# Altium project PS1-1BC.PrjPcb
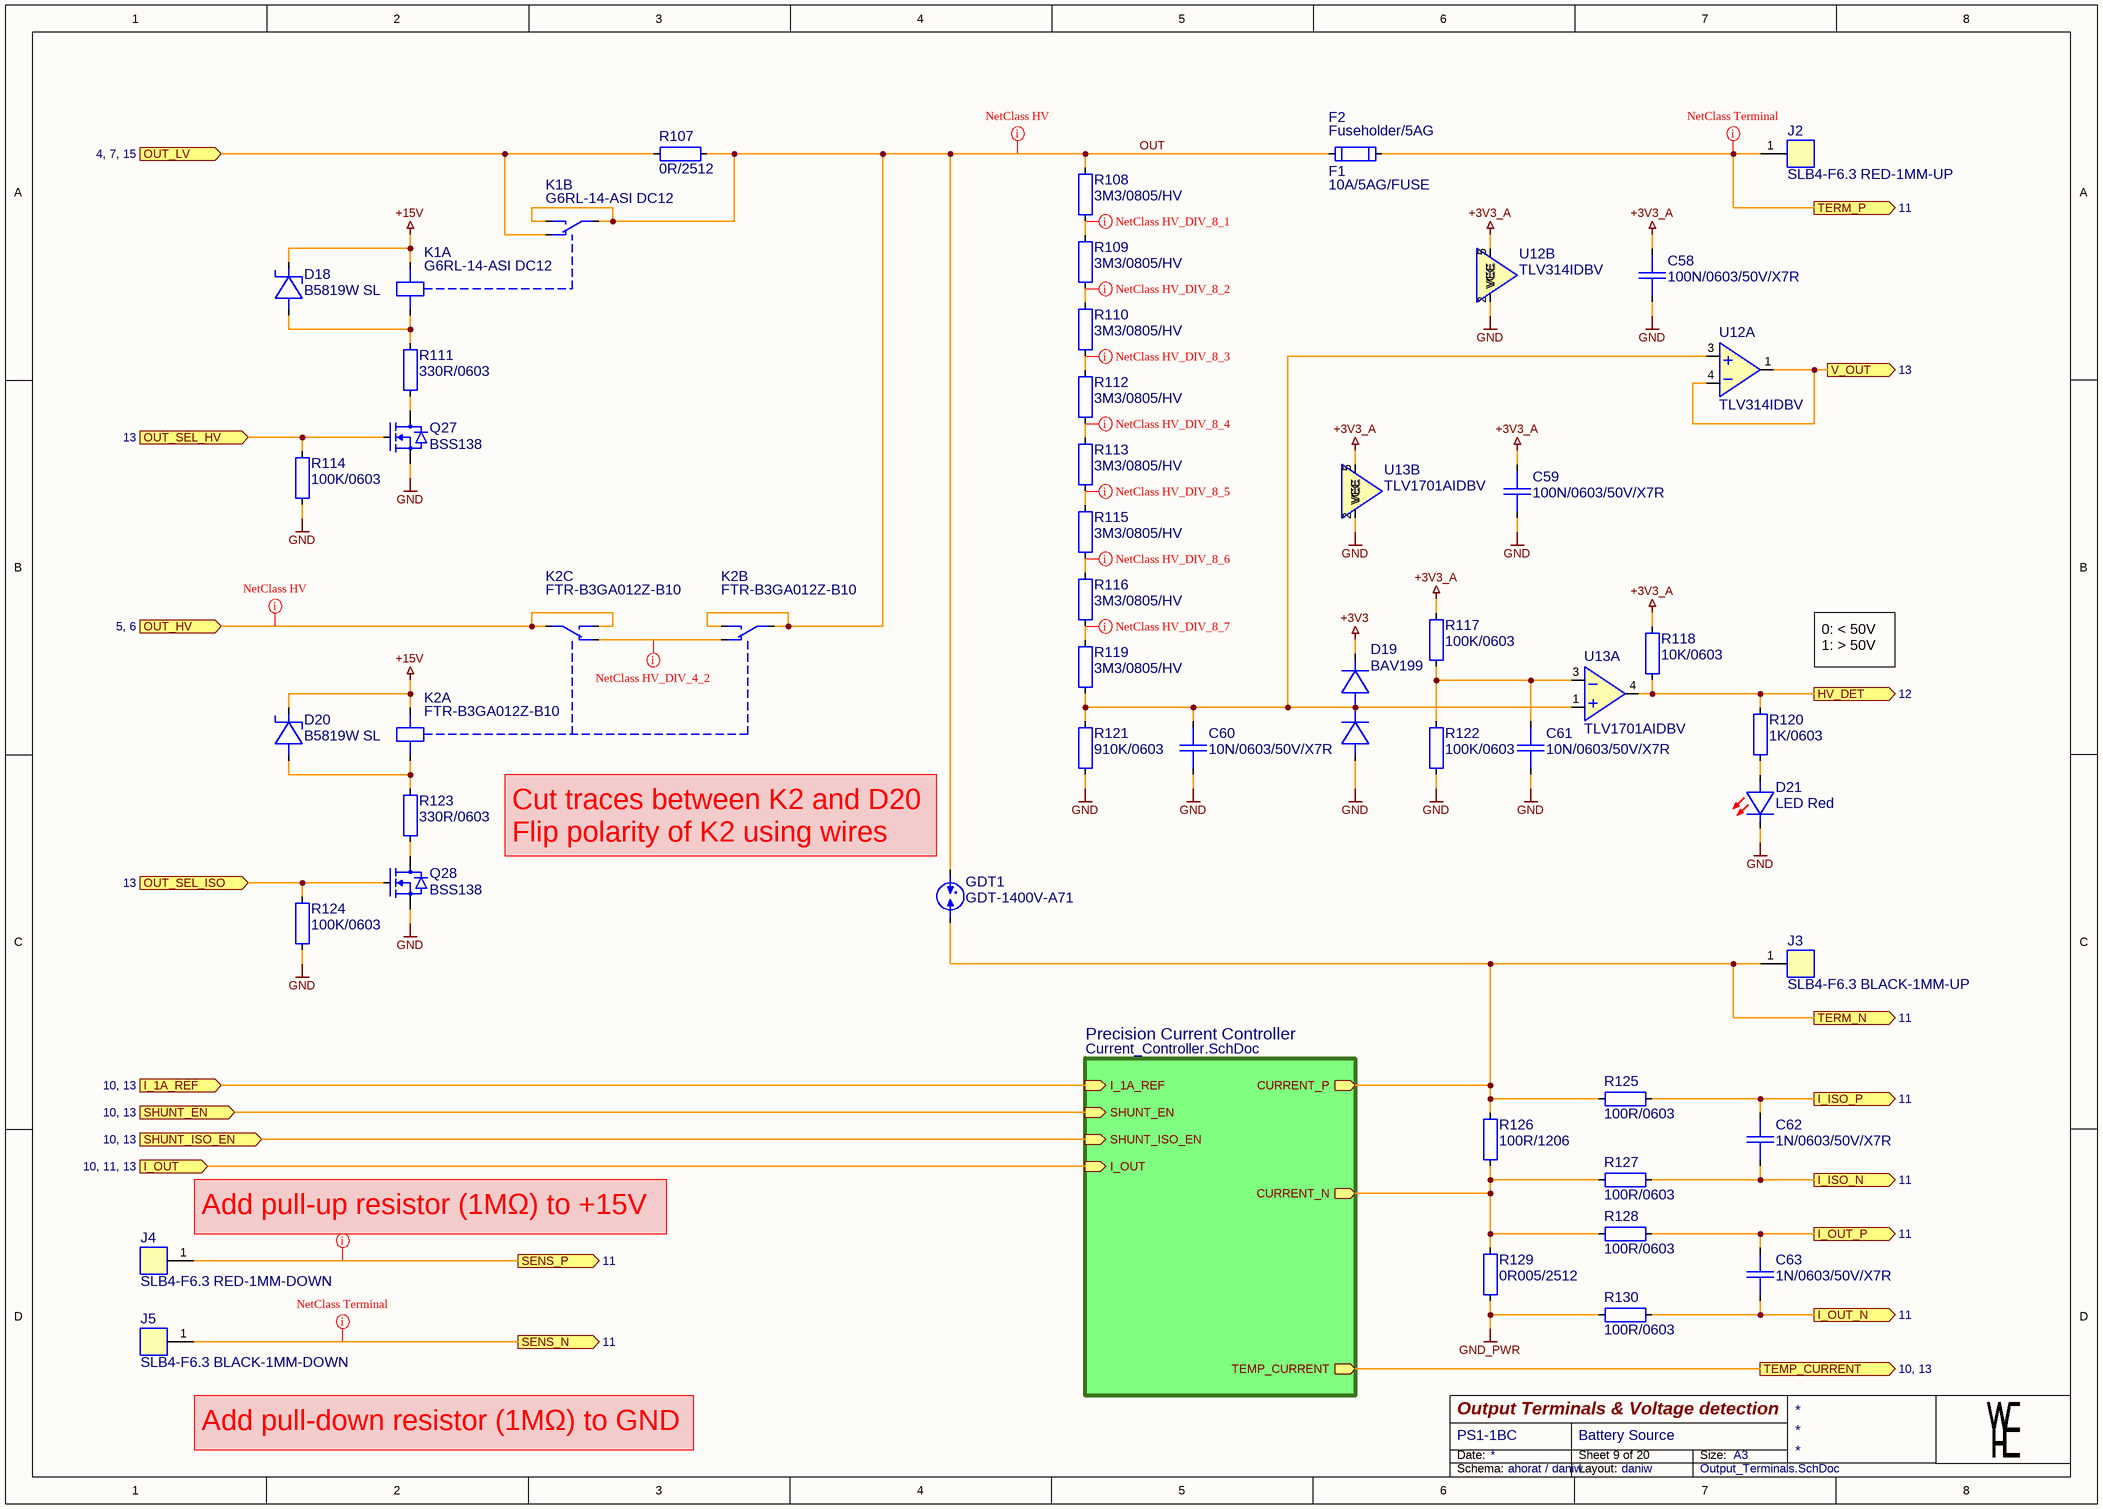
[diagram p0: Output_Terminals.SchDoc]
Schema_Designer: ahorat / daniw; Project_URL: https://github.com/daniw/bat_source; Project: Battery Source; PCB_NAME: PS1-1; Layout_Designer: daniw; Index_Sub: C; Index_Main: B; Author: ahorat / daniw
1 sheet, 47 parts. Net scope: hierarchical (ports join the sheet entries above them; power ports are global).
Board files: PS1-1B-BASIS.PcbDoc, PS1-1B-PANEL.PcbDoc

## Sheet Output_Terminals.SchDoc: Output Terminals & Voltage detection
size A3; DocumentNumber: 9; SheetNumber: 9; SheetTotal: 20

### Parts
C58  100N/0603/50V/X7R  [CAP0603_X7R]
C59  100N/0603/50V/X7R  [CAP0603_X7R]
C60  10N/0603/50V/X7R  [CAP0603_X7R]
C61  10N/0603/50V/X7R  [CAP0603_X7R]
C62  1N/0603/50V/X7R  [CAP0603_X7R]
C63  1N/0603/50V/X7R  [CAP0603_X7R]
D18  B5819W SL  [SOD3718X125]
D19  BAV199  [SOT2395P280X125-3-SE]
D20  B5819W SL  [SOD3718X125]
D21  LED Red  [LED0805_RED]
F1  10A/5AG/FUSE  [Fuse_5AG_5mm]
F2  Fuseholder/5AG  [KEYSTONE_3576]
GDT1  GDT-1400V-A71  [GDTAD1200W100L800D800H1200]
J2  SLB4-F6.3 RED-1MM-UP  [SLB4-F6.3-RED]
J3  SLB4-F6.3 BLACK-1MM-UP  [SLB4-F6.3-BLACK]
J4  SLB4-F6.3 RED-1MM-DOWN  [SLB4-F6.3-RED]
J5  SLB4-F6.3 BLACK-1MM-DOWN  [SLB4-F6.3-BLACK]
K1  G6RL-14-ASI DC12  [G6RL-1]  (parts A,B of 2)
K2  FTR-B3GA012Z-B10  [FTR-B3G]  (parts A,B,C of 3)
Q27  BSS138  [SOT2395P280X125-3-SE]
Q28  BSS138  [SOT2395P280X125-3-SE]
R107  0R/2512  [R2512-0.65-WW]
R108  3M3/0805/HV  [R0805-0.50-HV-WW]
R109  3M3/0805/HV  [R0805-0.50-HV-WW]
R110  3M3/0805/HV  [R0805-0.50-HV-WW]
R111  330R/0603  [R0603-0.40-WW]
R112  3M3/0805/HV  [R0805-0.50-HV-WW]
R113  3M3/0805/HV  [R0805-0.50-HV-WW]
R114  100K/0603  [R0603-0.40-WW]
R115  3M3/0805/HV  [R0805-0.50-HV-WW]
R116  3M3/0805/HV  [R0805-0.50-HV-WW]
R117  100K/0603  [R0603-0.40-WW]
R118  10K/0603  [R0603-0.40-WW]
R119  3M3/0805/HV  [R0805-0.50-HV-WW]
R120  1K/0603  [R0603-0.40-WW]
R121  910K/0603  [R0603-0.40-WW]
R122  100K/0603  [R0603-0.40-WW]
R123  330R/0603  [R0603-0.40-WW]
R124  100K/0603  [R0603-0.40-WW]
R125  100R/0603  [R0603-0.40-WW]
R126  100R/1206  [R1206-0.80-WW]
R127  100R/0603  [R0603-0.40-WW]
R128  100R/0603  [R0603-0.40-WW]
R129  0R005/2512  [R2512-0.65-WW]
R130  100R/0603  [R0603-0.40-WW]
U12  TLV314IDBV  [SOT2395P280X125-5-NW]  (parts A,B of 2)
U13  TLV1701AIDBV  [SOT2395P280X125-5-NW]  (parts A,B of 2)

### Sub-sheets
Precision Current Controller = Current_Controller.SchDoc (file not in this document): I_1A_REF (in), SHUNT_EN (in), SHUNT_ISO_EN (in), I_OUT (in), TEMP_CURRENT (out), CURRENT_P (out), CURRENT_N (out)

### Ports
HV_DET (out, see 12), I_1A_REF (in, see 10, 13), I_ISO_N (out, see 11), I_ISO_P (out, see 11), I_OUT (in, see 10, 11, 13), I_OUT_N (out, see 11), I_OUT_P (out, see 11), OUT_HV (in, see 5, 6), OUT_LV (in, see 4, 7, 15), OUT_SEL_HV (in, see 13), OUT_SEL_ISO (in, see 13), SENS_N (out, see 11), SENS_P (out, see 11), SHUNT_EN (in, see 10, 13), SHUNT_ISO_EN (in, see 10, 13), TEMP_CURRENT (out, see 10, 13), TERM_N (out, see 11), TERM_P (out, see 11), V_OUT (out, see 13)

### Nets
+3V3: D19.2(K2)
+3V3_A: C58.1 C59.1 R117.1 R118.1 U12.5(VCC) U13.5(VCC)
+15V: D18.1(C) D20.1(C) K1.2 K2.2
GND: C58.2 C59.2 C60.2 C61.2 D19.1(A1) D21.1(C) Q27.2(SOURCE) Q28.2(SOURCE) R114.2 R121.2 R122.2 R124.2 U12.2(VEE) U13.2(VEE)
GND_PWR: R129.2 R130.1
OUT: F2.1 GDT1.1 K1.3(COM1) K1.5(NO1) K2.3(COM1) K2.5(NO1) R107.1 R108.1
NetC60_1: C60.1 D19.3(K1/A2) R119.2 R121.1 U12.3(IN+) U13.1(IN+)
NetC61_1: C61.1 R117.2 R122.1 U13.3(IN-)
NetC62_1: C62.1 R125.2 ; port I_ISO_P
NetC62_2: C62.2 R127.2 ; port I_ISO_N
NetC63_1: C63.1 R128.2 ; port I_OUT_P
NetC63_2: C63.2 R130.2 ; port I_OUT_N
NetD18_2: D18.2(A) K1.1 R111.1
NetD20_2: D20.2(A) K2.1 R123.1
NetD21_2: D21.2(A) R120.1
NetF2_2: F2.2 J2.1 ; port TERM_P
NetGDT1_2: GDT1.2 J3.1 R125.1 R126.1 ; port TERM_N, sheet Precision Current Controller/CURRENT_P
NetJ4_1: J4.1 ; port SENS_P
NetJ5_1: J5.1 ; port SENS_N
NetK1_4: K1.4(NC1) R107.2 ; port OUT_LV
NetK2_4: K2.4(NC1) K2.7(NC2)
NetK2_6: K2.6(COM2) K2.8(NO2) ; port OUT_HV
NetQ27_1: Q27.1(GATE) R114.1 ; port OUT_SEL_HV
NetQ27_3: Q27.3(DRAIN) R111.2
NetQ28_1: Q28.1(GATE) R124.1 ; port OUT_SEL_ISO
NetQ28_3: Q28.3(DRAIN) R123.2
NetR108_2: R108.2 R109.1
NetR109_2: R109.2 R110.1
NetR110_2: R110.2 R112.1
NetR112_2: R112.2 R113.1
NetR113_2: R113.2 R115.1
NetR115_2: R115.2 R116.1
NetR116_2: R116.2 R119.1
NetR118_2: R118.2 R120.2 U13.4(OUT) ; port HV_DET
NetR126_2: R126.2 R127.1 R128.1 R129.1 ; sheet Precision Current Controller/CURRENT_N
NetU12_1: U12.1(OUT) U12.4(IN-) ; port V_OUT
(unnamed): port I_1A_REF, sheet Precision Current Controller/I_1A_REF
(unnamed): port SHUNT_EN, sheet Precision Current Controller/SHUNT_EN
(unnamed): port SHUNT_ISO_EN, sheet Precision Current Controller/SHUNT_ISO_EN
(unnamed): port I_OUT, sheet Precision Current Controller/I_OUT
(unnamed): port TEMP_CURRENT, sheet Precision Current Controller/TEMP_CURRENT

### Layout directives
net class HV: NetK2_6, OUT
net class Terminal: NetF2_2, NetJ4_1, NetJ5_1
net class HV_DIV_8_1: NetR108_2
net class HV_DIV_8_2: NetR109_2
net class HV_DIV_8_3: NetR110_2
net class HV_DIV_4_2: NetK2_4
net class HV_DIV_8_4: NetR112_2
net class HV_DIV_8_5: NetR113_2
net class HV_DIV_8_6: NetR115_2
net class HV_DIV_8_7: NetR116_2

### Notes on the sheet
- 0: < 50V
  1: > 50V
- (near GDT1) Cut traces between K2 and D20
  Flip polarity of K2 using wires
- Alternate relay options:
  - IM06CGR
  (fits on same footprint)
  - IM06JR
  (requires different footprint)
- (near J4) Add pull-up resistor (1MΩ) to +15V
- Add pull-down resistor (1MΩ) to GND
- Date:
- Size:
- A3
- Schema:
- Layout:

### Library data of the parts
C58 C59 = 100N/0603/50V/X7R: CAP SM 0603 100nF 50V X7R; Manufacturer: GENERIC; Manufacturer 1: YAGEO; Manufacturer Part Number 1: CC0603KPX7R9BB104; Absolute Value: 1E-7; Eurocircuits GPN: GPC0603104; Part Number: 100N/0603/50V/X7R; Package: 0603; Value: 100nF; HelpURL: https://www.yageo.com/upload/media/product/app/datasheet/mlcc/upy-gphc_x7r_6_3v-to-250v.pdf; Supplier 1: Digi-Key; Supplier Part Number 1: 311-3567-1-ND; Supplier 3: LCSC; Supplier Part Number 3: C14663; Manufacturer 2: YAGEO; Manufacturer Part Number 2: CC0603MRX7R9BB104; Supplier 2: Digi-Key; Supplier Part Number 2: 311-4110-1-ND; JLC Type: Basic; Manufacturer Part Number 3: CC0603KRX7R9BB104
C60 C61 = 10N/0603/50V/X7R: CAP SM 0603 10nF 50V X7R; Manufacturer: GENERIC; Manufacturer 1: YAGEO; Manufacturer Part Number 1: CC0603KPX7R9BB103; Absolute Value: 1E-8; Eurocircuits GPN: GPC0603103; Part Number: 10N/0603/50V/X7R; Package: 0603; Value: 10nF; HelpURL: https://www.yageo.com/upload/media/product/app/datasheet/mlcc/upy-gphc_x7r_6_3v-to-250v.pdf; Supplier 1: Digi-Key; Supplier Part Number 1: 311-1572-1-ND; Manufacturer 2: YAGEO; Manufacturer Part Number 2: CC0603KRX7R9BB103; Supplier 2: Digi-Key; Supplier Part Number 2: 311-1085-1-ND; Manufacturer Part Number 3: CC0603KRX7R9BB103; Supplier 3: LCSC; Supplier Part Number 3: C100042
C62 C63 = 1N/0603/50V/X7R: CAP SM 0603 1.0nF 50V X7R; Manufacturer: GENERIC; Manufacturer 1: YAGEO; Manufacturer Part Number 1: CC0603KPX7R9BB102; Absolute Value: 1E-9; Eurocircuits GPN: GPC0603102; Part Number: 1N/0603/50V/X7R; Package: 0603; Value: 1.0nF; HelpURL: https://www.yageo.com/upload/media/product/app/datasheet/mlcc/upy-gphc_x7r_6_3v-to-250v.pdf; Supplier 1: Digi-Key; Supplier Part Number 1: 13-CC0603KPX7R9BB102CT-ND; Manufacturer 2: YAGEO; Manufacturer Part Number 2: CC0603KRX7R9BB102; Supplier 2: Digi-Key; Supplier Part Number 2: 311-1080-1-ND; JLC Type: Basic; Manufacturer Part Number 3: CL10B102KB8NNNC; Supplier 3: LCSC; Supplier Part Number 3: C1588
D18 D20 = B5819W SL: 40V 600mV@1A 1A SOD-123 Schottky Barrier Diodes; Manufacturer: GENERIC; Manufacturer 1: SMC Diode Solutions; Part Number: B5819W SL; Package: SOD-123; Value: B5819W SL; Absolute Value: 40V; HelpURL: https://datasheet.lcsc.com/lcsc/2304140030_Jiangsu-Changjing-Electronics-Technology-Co---Ltd--B5819W-SL_C8598.pdf; Manufacturer Part Number 1: B5819WSL; Supplier 1: Digikey; Supplier Part Number 1: 1655-B5819WSLCT-ND; Manufacturer 3: Jiangsu Changjing Electronics Technology Co., Ltd.; Manufacturer Part Number 3: B5819W SL; Supplier 3: LCSC; Supplier Part Number 3: C8598; JLC Type: Basic
D19 = BAV199: Silicon Low Leakage Diode 85V; Manufacturer: Infineon Technologies; Manufacturer Part Number 1: BAV199E6433HTMA1; Part Number: BAV199; Package: SOT23; Value: BAV199; Absolute Value: 85V; HelpURL: https://www.infineon.com/dgdl/bav199series.pdf?folderId=db3a30431400ef6801141c748874044e&fileId=db3a30431400ef6801141cba733104e5; Manufacturer 1: Infineon Technologies; Supplier 1: Digikey; Supplier Part Number 1: BAV199E6433HTMA1CT-ND; Manufacturer 3: LRC; Manufacturer Part Number 3: LBAV199LT1G; Supplier 3: LCSC; Supplier Part Number 3: C12740
D21 = LED Red 0805: Generic LED Red 0805; Manufacturer 1: Würth; Manufacturer Part Number 1: 150080RS75000; Part Number: LED Red 0805; Manufacturer: GENERIC; Package: 805; Value: Red; Absolute Value: Red; HelpURL: https://www.we-online.com/katalog/datasheet/150060RS75000.pdf; Supplier 1: Digikey; Supplier Part Number 1: 732-4984-1-ND; Manufacturer 3: Foshan NationStar Optoelectronics; Manufacturer Part Number 3: NCD0805R1; Supplier 3: LCSC; Supplier Part Number 3: C84256; JLC Type: Basic
F1 = 10A/5AG/FUSE: Fuse 1000V AC/DC 10A 5AG 10.3x38mm; Manufacturer: Phoenix Contact; Manufacturer Part Number 1: 3061334; Part Number: 10A/5AG/FUSE; Package: 5AG; Value: 10A; HelpURL: https://www.phoenixcontact.com/us/products/3061334/pdf; Manufacturer 1: Phoenix Contact; Supplier 1: Digi-Key; Supplier Part Number 1: 277-15212-ND
F2 = Fuseholder/5AG: Manufacturer 1: Keystone Electronics; Manufacturer Part Number 1: 3576; Part Number: Fuseholder/5AG; Supplier 1: Digi-Key; Supplier Part Number 1: 36-3576-ND; HelpURL: https://www.keyelco.com/product-pdf.cfm?p=347; Package: 5AG; Manufacturer 2: Keystone Electronics; Manufacturer Part Number 2: 3576; Supplier 2: Mouser; Supplier Part Number 2: 534-3576
GDT1 = GDT-1400V-A71-12MM-4MM: 2-electrode surge arrester, 1400V, 10kA, A71 series, 12mm lead spacing, 4mm standoff height; Manufacturer: TDK; Manufacturer 1: EPCOS - TDK Electronics; Manufacturer Part Number 1: B88069X2180S102; Absolute Value: 1400; Part Number: GDT-1400V-A71-12MM-4MM; Package: Axial; Value: 1400V; HelpURL: https://www.tdk-electronics.tdk.com/inf/100/ds/A71-H14X-X2180S102.pdf; Supplier 1: Digi-Key; Supplier Part Number 1: 495-4270-ND; Manufacturer 2: EPCOS - TDK Electronics; Manufacturer Part Number 2: B88069X3500T502; Supplier 2: Digi-Key; Supplier Part Number 2: 495-5911-1-ND
J2 = SLB4-F6.3 RED-1MM-UP: SLB4-F6.3 Insulated, rigid, Ø 4 mm, accepting spring-loaded Ø 4 mm plugs with rigid insulating sleeve. Machined brass. Insulation material UL94 V-0. The socket is screwed into pre-drilled panels of plastic, metal, etc. Flat connecting tab 6.3 mm x 0.8 mm.; Manufacturer: Stäubli; Manufacturer 1: Stäubli Electrical Connectors; Manufacturer Part Number 1: 23.3060-22; System: Connector; Part Number: SLB4-F6.3 RED-1MM-UP; HelpURL: https://www.staubli.com/content/dam/ecs/technical-documentation/datasheets/TM/23.3060_en.pdf; Supplier 1: Distrelec; Supplier Part Number 1: 30136218
J3 = SLB4-F6.3 BLACK-1MM-UP: SLB4-F6.3 Insulated, rigid, Ø 4 mm, accepting spring-loaded Ø 4 mm plugs with rigid insulating sleeve. Machined brass. Insulation material UL94 V-0. The socket is screwed into pre-drilled panels of plastic, metal, etc. Flat connecting tab 6.3 mm x 0.8 mm.; Manufacturer: Stäubli; Manufacturer 1: Stäubli Electrical Connectors; Manufacturer Part Number 1: 23.3060-21; System: Connector; Part Number: SLB4-F6.3 BLACK-1MM-UP; HelpURL: https://www.staubli.com/content/dam/ecs/technical-documentation/datasheets/TM/23.3060_en.pdf; Supplier 1: Distrelec; Supplier Part Number 1: 30136217
J4 = SLB4-F6.3 RED-1MM-DOWN: SLB4-F6.3 Insulated, rigid, Ø 4 mm, accepting spring-loaded Ø 4 mm plugs with rigid insulating sleeve. Machined brass. Insulation material UL94 V-0. The socket is screwed into pre-drilled panels of plastic, metal, etc. Flat connecting tab 6.3 mm x 0.8 mm.; Manufacturer: Stäubli; Manufacturer 1: Stäubli Electrical Connectors; Manufacturer Part Number 1: 23.3060-22; System: Connector; Part Number: SLB4-F6.3 RED-1MM-DOWN; HelpURL: https://www.staubli.com/content/dam/ecs/technical-documentation/datasheets/TM/23.3060_en.pdf; Supplier 1: Distrelec; Supplier Part Number 1: 30136218
J5 = SLB4-F6.3 BLACK-1MM-DOWN: SLB4-F6.3 Insulated, rigid, Ø 4 mm, accepting spring-loaded Ø 4 mm plugs with rigid insulating sleeve. Machined brass. Insulation material UL94 V-0. The socket is screwed into pre-drilled panels of plastic, metal, etc. Flat connecting tab 6.3 mm x 0.8 mm.; Manufacturer: Stäubli; Manufacturer 1: Stäubli Electrical Connectors; Manufacturer Part Number 1: 23.3060-21; System: Connector; Part Number: SLB4-F6.3 BLACK-1MM-DOWN; HelpURL: https://www.staubli.com/content/dam/ecs/technical-documentation/datasheets/TM/23.3060_en.pdf; Supplier 1: Distrelec; Supplier Part Number 1: 30136217
K1 = G6RL-14-ASI DC12: RELAY GEN PURPOSE SPDT 8A 12V; Manufacturer: Omron Electronics Inc-EMC Div; Part Number: G6RL-14-ASI DC12; HelpURL: https://omronfs.omron.com/en_US/ecb/products/pdf/en-g6rl.pdf; Manufacturer 1: Omron Electronics Inc-EMC Div; Manufacturer Part Number 1: G6RL-14-ASI DC12; Supplier 1: Digi-Key; Supplier Part Number 1: 39-G6RL-14-ASIDC12-ND
K2 = FTR-B3GA012Z-B10: FTR-B3 Series Ultra Miniature Relay 2 Poles - 2 A (Low Profile Signal Relay); Manufacturer: Fujitsu; Part Number: FTR-B3GA012Z-B10; HelpURL: https://www.fujitsu.com/sg/imagesgig5/ftr-b3.pdf; Manufacturer 3: FUJITSU; Manufacturer Part Number 3: FTR-B3GA012Z-B10; Supplier 3: LCSC; Supplier Part Number 3: C2992429; JLC Type: Extended
Q27 Q28 = BSS138: N-Kanal 50 V 220mA (Ta) 350mW (Ta) Oberflächenmontage SOT-23; Manufacturer: GENERIC; Manufacturer 1: ANBON SEMICONDUCTOR (INT'L) LIMITED; Part Number: BSS138; Package: SOT23; HelpURL: https://mm.digikey.com/Volume0/opasdata/d220001/medias/docus/3037/BSS138.pdf; Manufacturer Part Number 1: BSS138; Supplier 1: Digi-Key; Supplier Part Number 1: 4530-BSS138CT-ND; Manufacturer 3: FOSAN; Manufacturer Part Number 3: BSS138; Supplier 3: LCSC; Supplier Part Number 3: C2926186; JLC Type: Extended; Manufacturer 2: FOSAN; Manufacturer Part Number 2: BSS138; Supplier 2: LCSC; Supplier Part Number 2: C2926186
R107 = 0R/2512: RES SM 2512 0R; Manufacturer: GENERIC; Absolute Value: 0; Part Number: 0R/2512; Package: 2512; Value: 0R
R108-R110 R112 R113 R115 R116 R119 = 3M3/0805/HV: RES SM 0805 3M3 High voltage; Manufacturer: GENERIC; Manufacturer 1: YAGEO; Manufacturer Part Number 1: RES SMD 3.3M OHM 1% 1/8W 0805; Absolute Value: 3300000; Part Number: 3M3/0805/HV; Package: 0805; Value: 3M3; HelpURL: https://www.yageogroup.com/content/datasheet/asset/file/PYU-RV_51_ROHS_L; Supplier 1: Digi-Key; Supplier Part Number 1: RV0805FR-073M3L-ND; Manufacturer 3: YAGEO; Manufacturer Part Number 3: RV0805FR-073M3L; Supplier 3: LCSC; Supplier Part Number 3: C873387; JLC Type: Extended
R111 R123 = 330R/0603: RES SM 0603 330R; Manufacturer: GENERIC; Manufacturer 1: YAGEO; Manufacturer Part Number 1: RC0603FR-13330RL; Absolute Value: 330; Eurocircuits GPN: GPR0603330R; Part Number: 330R/0603; Package: 0603; Value: 330R; HelpURL: https://www.yageogroup.com/content/datasheet/asset/file/PYU-RC_GROUP_51_ROHS_L; Supplier 1: Digi-Key; Supplier Part Number 1: 13-RC0603FR-13330RLCT-ND; Manufacturer 2: YAGEO; Manufacturer Part Number 2: RC0603FR-10330RL; Supplier 2: Digi-Key; Supplier Part Number 2: 13-RC0603FR-10330RLCT-ND; Manufacturer 3: UNI-ROYAL(Uniroyal Elec); Manufacturer Part Number 3: 0603WAF3300T5E; Supplier 3: LCSC; Supplier Part Number 3: C23138; JLC Type: Basic
R114 R117 R122 R124 = 100K/0603: RES SM 0603 100K; Manufacturer: GENERIC; Manufacturer 1: YAGEO; Manufacturer Part Number 1: RC0603FR-13100KL; Absolute Value: 100000; Eurocircuits GPN: GPR0603100K; Part Number: 100K/0603; Package: 0603; Value: 100K; HelpURL: https://www.yageogroup.com/content/datasheet/asset/file/PYU-RC_GROUP_51_ROHS_L; Supplier 1: Digi-Key; Supplier Part Number 1: 13-RC0603FR-13100KLCT-ND; Manufacturer 2: YAGEO; Manufacturer Part Number 2: RC0603FR-10100KL; Supplier 2: Digi-Key; Supplier Part Number 2: 13-RC0603FR-10100KLCT-ND; Manufacturer 3: UNI-ROYAL(Uniroyal Elec); Manufacturer Part Number 3: 0603WAF1003T5E; Supplier 3: LCSC; Supplier Part Number 3: C25803; JLC Type: Basic
R118 = 10K/0603: RES SM 0603 10K; Manufacturer: GENERIC; Manufacturer 1: YAGEO; Manufacturer Part Number 1: RC0603FR-1310KL; Absolute Value: 10000; Eurocircuits GPN: GPR060310K; Part Number: 10K/0603; Package: 0603; Value: 10K; HelpURL: https://www.yageogroup.com/content/datasheet/asset/file/PYU-RC_GROUP_51_ROHS_L; Supplier 1: Digi-Key; Supplier Part Number 1: 13-RC0603FR-1310KLCT-ND; Manufacturer 2: YAGEO; Manufacturer Part Number 2: RC0603FR-1010KL; Supplier 2: Digi-Key; Supplier Part Number 2: 13-RC0603FR-1010KLCT-ND; Manufacturer 3: UNI-ROYAL(Uniroyal Elec); Manufacturer Part Number 3: 0603WAF1002T5E; Supplier 3: LCSC; Supplier Part Number 3: C25804; JLC Type: Basic
R120 = 1K/0603: RES SM 0603 1K; Manufacturer: GENERIC; Manufacturer 1: YAGEO; Manufacturer Part Number 1: RC0603FR-131KL; Absolute Value: 1000; Eurocircuits GPN: GPR06031K; Part Number: 1K/0603; Package: 0603; Value: 1K; HelpURL: https://www.yageogroup.com/content/datasheet/asset/file/PYU-RC_GROUP_51_ROHS_L; Supplier 1: Digi-Key; Supplier Part Number 1: 13-RC0603FR-131KLCT-ND; Manufacturer 2: YAGEO; Manufacturer Part Number 2: RC0603FR-101KL; Supplier 2: Digi-Key; Supplier Part Number 2: 13-RC0603FR-101KLCT-ND; Manufacturer 3: UNI-ROYAL(Uniroyal Elec); Manufacturer Part Number 3: 0603WAF1001T5E; Supplier 3: LCSC; Supplier Part Number 3: C21190; JLC Type: Basic
R121 = 910K/0603: RES SM 0603 910K; Manufacturer: GENERIC; Manufacturer 1: YAGEO; Manufacturer Part Number 1: RC0603FR-07910KL; Absolute Value: 910000; Eurocircuits GPN: GPR0603910K; Part Number: 910K/0603; Package: 0603; Value: 910K; HelpURL: https://www.yageogroup.com/content/datasheet/asset/file/PYU-RC_GROUP_51_ROHS_L; Supplier 1: Digi-Key; Supplier Part Number 1: 311-910KHRCT-ND; JLC Type: Extended; Manufacturer 3: YAGEO; Manufacturer Part Number 3: RC0603FR-07910KL; Supplier 3: LCSC; Supplier Part Number 3: C137672
R125 R127 R128 R130 = 100R/0603: RES SM 0603 100R; Manufacturer: GENERIC; Manufacturer 1: YAGEO; Manufacturer Part Number 1: RC0603FR-13100RL; Absolute Value: 100; Eurocircuits GPN: GPR0603100R; Part Number: 100R/0603; Package: 0603; Value: 100R; HelpURL: https://www.yageogroup.com/content/datasheet/asset/file/PYU-RC_GROUP_51_ROHS_L; Supplier 1: Digi-Key; Supplier Part Number 1: 13-RC0603FR-13100RLCT-ND; Manufacturer 2: YAGEO; Manufacturer Part Number 2: RC0603FR-10100RL; Supplier 2: Digi-Key; Supplier Part Number 2: 13-RC0603FR-10100RLCT-ND; Manufacturer 3: UNI-ROYAL(Uniroyal Elec); Manufacturer Part Number 3: 0603WAF1000T5E; Supplier 3: LCSC; Supplier Part Number 3: C22775
R126 = 100R/1206: RES SM 1206 100R; Manufacturer: GENERIC; Manufacturer 1: YAGEO; Manufacturer Part Number 1: RC1206FR-07100RL; Absolute Value: 100; Part Number: 100R/1206; Package: 1206; Value: 100R; HelpURL: https://www.yageogroup.com/content/datasheet/asset/file/PYU-RC_GROUP_51_ROHS_L; Supplier 1: Digi-Key; Supplier Part Number 1: 311-100FRCT-ND; Manufacturer 3: UNI-ROYAL(Uniroyal Elec); Manufacturer Part Number 3: 1206W4F1000T5E; Supplier 3: LCSC; Supplier Part Number 3: C17901
R129 = 0R005/2512: RES SM 2512 0R005; Manufacturer: GENERIC; Manufacturer 1: Ohmite; Manufacturer Part Number 1: MCS3264R005FER; Absolute Value: 0.005; Part Number: 0R005/2512; Package: 2512; Value: 0R005; HelpURL: https://www.ohmite.com/assets/docs/res_mcs.pdf?r=false; Supplier 1: Digi-Key; Supplier Part Number 1: MCS3264R005FERCT-ND; Manufacturer 3: prosemi; Manufacturer Part Number 3: LMP25MF2P0R005; Supplier 3: LCSC; Supplier Part Number 3: C2937402
U12 = TLV314 SOT23: TLV314, 3-MHz, Low-Power, Internal EMI Filter, RRIO, Operational Amplifier; Manufacturer: Texas Instruments; Manufacturer Part Number 1: TLV314IDBVR; Part Number: TLV314 SOT23; Package: SOT23-5; HelpURL: https://www.ti.com/lit/ds/symlink/tlv4314.pdf; Manufacturer 1: Texas Instruments; Supplier 1: Digi-Key; Supplier Part Number 1: 296-46275-1-ND; Manufacturer 3: Texas Instruments; Manufacturer Part Number 3: TLV314IDBVR; Supplier 3: LCSC; Supplier Part Number 3: C133032; Manufacturer 2: Texas Instruments; Manufacturer Part Number 2: TLV314IDBVT; Supplier 2: Digi-Key; Supplier Part Number 2: 296-44110-2-ND
U13 = TLV1701 SOT23: TLV1701 2.2-V to 36-V, microPower Comparato; Manufacturer: Texas Instruments; Manufacturer Part Number 1: TLV1701AIDBVR; Part Number: TLV1701 SOT23; Package: SOT23-5; HelpURL: https://www.ti.com/lit/ds/symlink/tlv1701.pdf; Manufacturer 1: Texas Instruments; Supplier 1: Digi-Key; Supplier Part Number 1: 296-40599-1-ND; Manufacturer 2: Texas Instruments; Manufacturer Part Number 2: TLV1701QDBVRQ1; Supplier 2: Digi-Key; Supplier Part Number 2: 296-47458-1-ND; Manufacturer 3: Texas Instruments; Manufacturer Part Number 3: TLV1701AIDBVR; Supplier 3: LCSC; Supplier Part Number 3: C130035

## Assembly variants
PS1-1: not fitted C95 C96 C128 C138 C145 D35 D36 L1 R48 R49 R107 R236 R238 Y2
PS1-10: not fitted C45 C46 C47 C48 C49 C50 C55 C56 C57 C62 C64 C65 C66 C67 C68 C69 C70 C78 C80 C81 C83 C84 C95 C96 C128 C138 C145 D9 D10 D11 D17 D18 D20 D22 D23 D24 D25 D30 D31 D32 D33 D35 D36 J4 J5 K1 K2 L1 L3 Q21 Q22 Q23 Q24 Q27 Q28 Q29 Q30 Q31 Q32 Q33 R48 R49 R60 R61 R62 R63 R64 R65 R66 R67 R68 R69 R70 R71 R72 R73 R74 R75 R76 R77 R78 R79 R97 R98 R99 R100 R101 R102 R103 R104 R105 R106 R111 R114 R123 R124 R125 R127 R131 R132 R133 R134 R135 R136 R137 R138 R139 R140 R141 R142 R143 R144 R145 R146 R147 R148 R149 R150 R151 R152 R153 R178 R179 R180 R181 R182 R183 R184 R185 R186 R187 R188 R189 R190 R191 R192 R193 R194 R195 R196 R197 R198 R199 R200 R201 R202 R236 R238 U7 U10 U11 U14 U19 U20 Y2; alternate parts U18 -> ADS131M02 TSSOP, R126 -> 0R/1206